# Altium schematic sheet 平衡模块SCH.SchDoc: 平衡模块电路
size A4; Author: 许皓阳 15电4; DrawnBy: Staok; Revision: 3.14
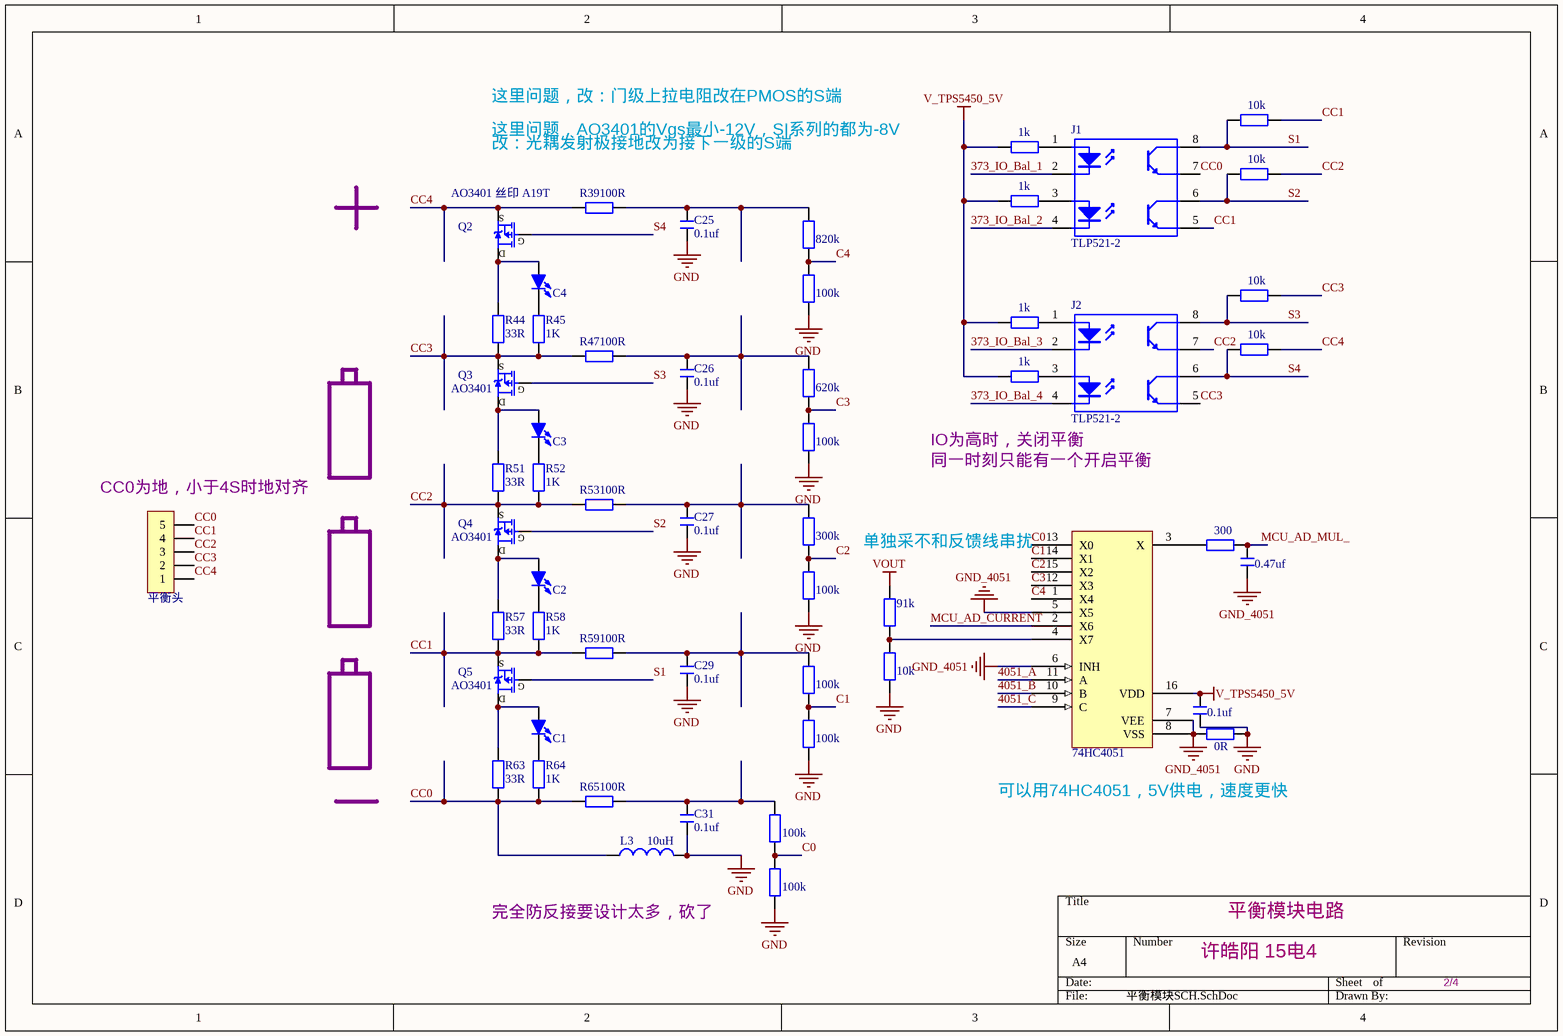
[diagram p0: 平衡模块SCH.SchDoc]

## Parts
11  91k  [R 0805_M]
12  10k  [R 0805_M]
*1  74HC4051  [SOP16_N]
C25  0.1uf  [C 0805_M]
C26  0.1uf  [C 0805_M]
C27  0.1uf  [C 0805_M]
C28  0.47uf  [C 0805_M]
C29  0.1uf  [C 0805_M]
C30  0.1uf  [C 0805_M]
C31  0.1uf  [C 0805_M]
J1  TLP521-2  [SOP8-W2.54_N]
J2  TLP521-2  [SOP8-W2.54_N]
JP9  平衡头  [XH2.54-WI-5P]
L3  10uH  [L 0805_M]
LED2  C4  [LED 0805G]
LED3  C3  [LED 0805G]
LED4  C2  [LED 0805G]
LED5  C1  [LED 0805G]
Q2  AO3401 丝印 A19T  [SOT23-3N]
Q3  AO3401  [SOT23-3N]
Q4  AO3401  [SOT23-3N]
Q5  AO3401  [SOT23-3N]
R35  10k  [R 0805_M]
R36  1k  [R 0805_M]
R37  10k  [R 0805_M]
R38  1k  [R 0805_M]
R39  100R  [R 0805_M]
R40  820k  [R 0805_M]
R41  100k  [R 0805_M]
R42  10k  [R 0805_M]
R43  1k  [R 0805_M]
R44  33R  [R 2512_L]
R45  1K  [R 0805_L]
R46  10k  [R 0805_M]
R47  100R  [R 0805_M]
R48  1k  [R 0805_M]
R49  620k  [R 0805_M]
R50  100k  [R 0805_M]
R51  33R  [R 2512_L]
R52  1K  [R 0805_L]
R53  100R  [R 0805_M]
R54  300k  [R 0805_M]
R55  300  [R 0805_M]
R56  100k  [R 0805_M]
R57  33R  [R 2512_L]
R58  1K  [R 0805_L]
R59  100R  [R 0805_M]
R60  100k  [R 0805_M]
R61  0R  [R 0805_M]
R62  100k  [R 0805_M]
R63  33R  [R 2512_L]
R64  1K  [R 0805_L]
R65  100R  [R 0805_M]
R66  100k  [R 0805_M]
R67  100k  [R 0805_M]

## Nets
GND: 12.2 C25.1 C26.1 C27.1 C29.1 C30.1 C31.1 L3.2 R41.2 R50.2 R56.2 R61.1 R62.2 R67.2
GND_4051: *1.5(X5) *1.6(INH) *1.7(VEE) *1.8(VSS) C28.1 R61.2
V_TPS5450_5V: *1.16(VDD) C30.2 R36.2 R38.2 R43.2 R48.2
VOUT: 11.1
373_IO_Bal_1: J1.2(1K)
373_IO_Bal_2: J1.4(2K)
373_IO_Bal_3: J2.2(1K)
373_IO_Bal_4: J2.4(2K)
4051_A: *1.11(A)
4051_B: *1.10(B)
4051_C: *1.9(C)
C0: *1.13(X0) R66.2 R67.1
C1: *1.14(X1) R60.2 R62.1
C2: *1.15(X2) R54.2 R56.1
C3: *1.12(X3) R49.2 R50.1
C4: *1.1(X4) R40.2 R41.1
CC0: J1.7(1E) JP9.5 L3.1 R63.1 R64.2 R65.2
CC1: J1.5(2E) JP9.4 Q5.2(S) R35.2 R57.1 R58.2 R59.2
CC2: J2.7(1E) JP9.3 Q4.2(S) R37.2 R51.1 R52.2 R53.2
CC3: J2.5(2E) JP9.2 Q3.2(S) R42.2 R44.1 R45.2 R47.2
CC4: JP9.1 Q2.2(S) R39.2 R46.2
MCU_AD_CURRENT: *1.2(X6)
MCU_AD_MUL_: C28.2 R55.1
S1: J1.8(1C) Q5.1(G) R35.1
S2: J1.6(2C) Q4.1(G) R37.1
S3: J2.8(1C) Q3.1(G) R42.1
S4: J2.6(2C) Q2.1(G) R46.1
Net11_2: 11.2 12.1 *1.4(X7)
Net*1_3: *1.3(X) R55.2
NetC25_2: C25.2 R39.1 R40.1
NetC26_2: C26.2 R47.1 R49.1
NetC27_2: C27.2 R53.1 R54.1
NetC29_2: C29.2 R59.1 R60.1
NetC31_2: C31.2 R65.1 R66.1
NetJ1_1: J1.1(1A) R36.1
NetJ1_3: J1.3(2A) R38.1
NetJ2_1: J2.1(1A) R43.1
NetJ2_3: J2.3(2A) R48.1
NetLED2_1: LED2.1(A) Q2.3(D) R44.2
NetLED2_2: LED2.2(K) R45.1
NetLED3_1: LED3.1(A) Q3.3(D) R51.2
NetLED3_2: LED3.2(K) R52.1
NetLED4_1: LED4.1(A) Q4.3(D) R57.2
NetLED4_2: LED4.2(K) R58.1
NetLED5_1: LED5.1(A) Q5.3(D) R63.2
NetLED5_2: LED5.2(K) R64.1

## Notes on the sheet
- 这里问题，改：门级上拉电阻改在PMOS的S端
- 这里问题，AO3401的Vgs最小-12V，SI系列的都为-8V
- 改：光耦发射极接地改为接下一级的S端
- IO为高时，关闭平衡
- (near JP9) CC0为地，小于4S时地对齐
- 同一时刻只能有一个开启平衡
- 单独采不和反馈线串扰
- 可以用74HC4051，5V供电，速度更快
- (near L3) 完全防反接要设计太多，砍了
- 2/4

## Library data of the parts
11 12 R35-R67 = R: 贴片电阻; 版权归属: 源创客; BOM名称: 贴片电阻; 学习资源: www.ooocke.com
*1 = CD4051
C25-C31 = C: 无极性贴片电容; 版权归属: 源创客; BOM名称: 无极性贴片电容; 学习资源: www.ooocke.com
J1 J2 = TLP521-2: 2路开关光耦; 版权归属: 源创客; BOM名称: 2路开关光耦; 学习资源: www.ooocke.com
JP9 = Header 5: 5P接插件; 版权归属: 源创客; BOM名称: 5P接插件; 学习资源: www.ooocke.com
L3 = L: 小功率贴片电感; 版权归属: 源创客; BOM名称: 小功率贴片电感; 学习资源: www.ooocke.com
LED2-LED5 = LED-SMD: 贴片LED; 版权归属: 源创客; BOM名称: 贴片LED; 学习资源: www.ooocke.com
Q2-Q5 = SI2301: P沟道 20V/2.8A; BOM名称: 场效应管; 版权归属: 源创客; 学习资源: www.ooocke.com; 描述: P沟道 20V/2.8A